# EAGLE design Ignition_speeduino (EAGLE 8.7.1)
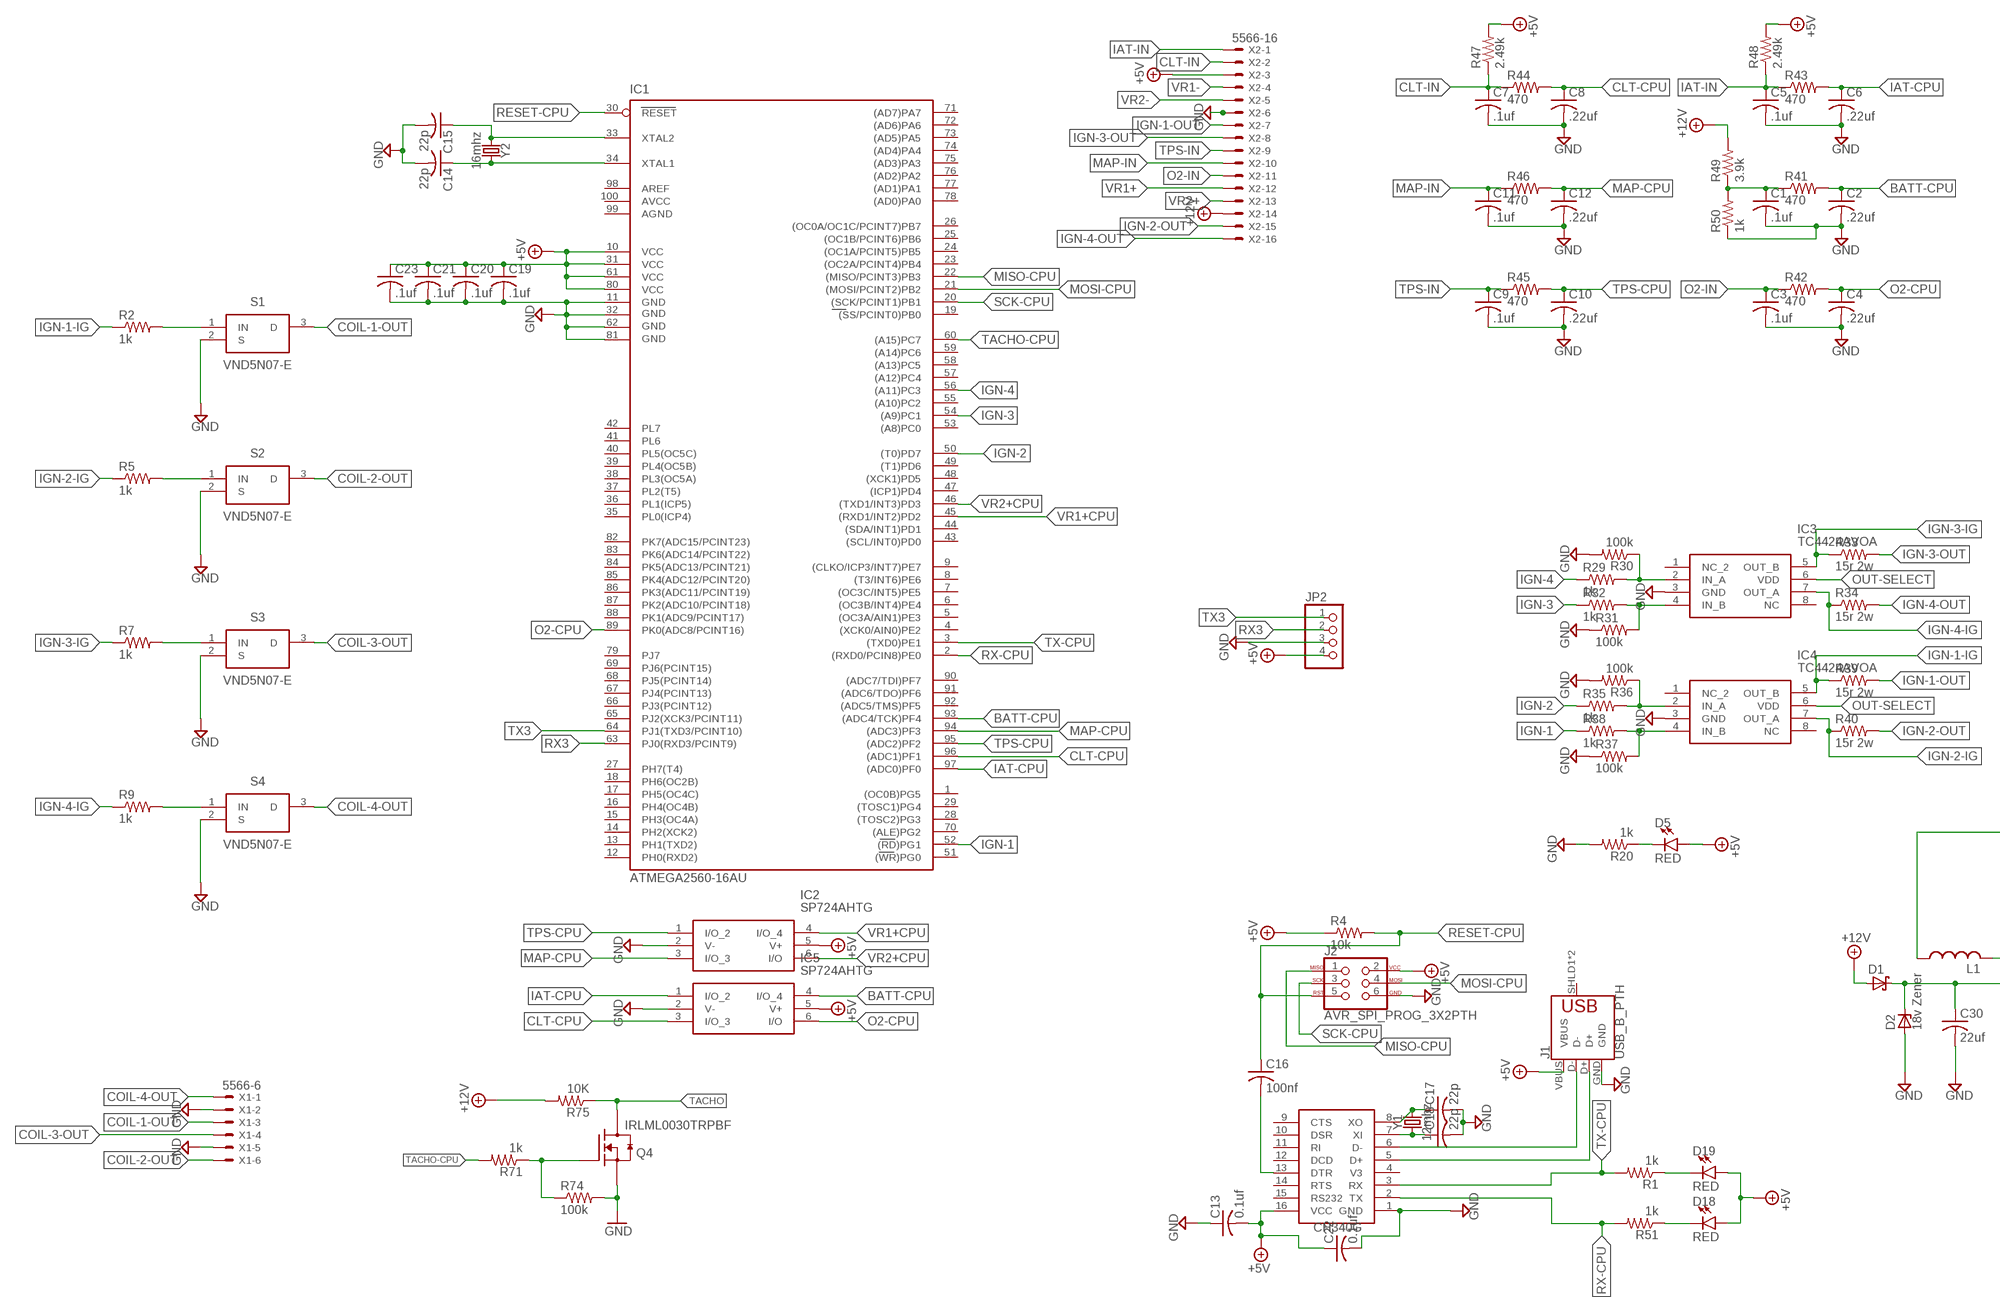
[diagram p0: schematic, sheet 1, part 1 of 2]
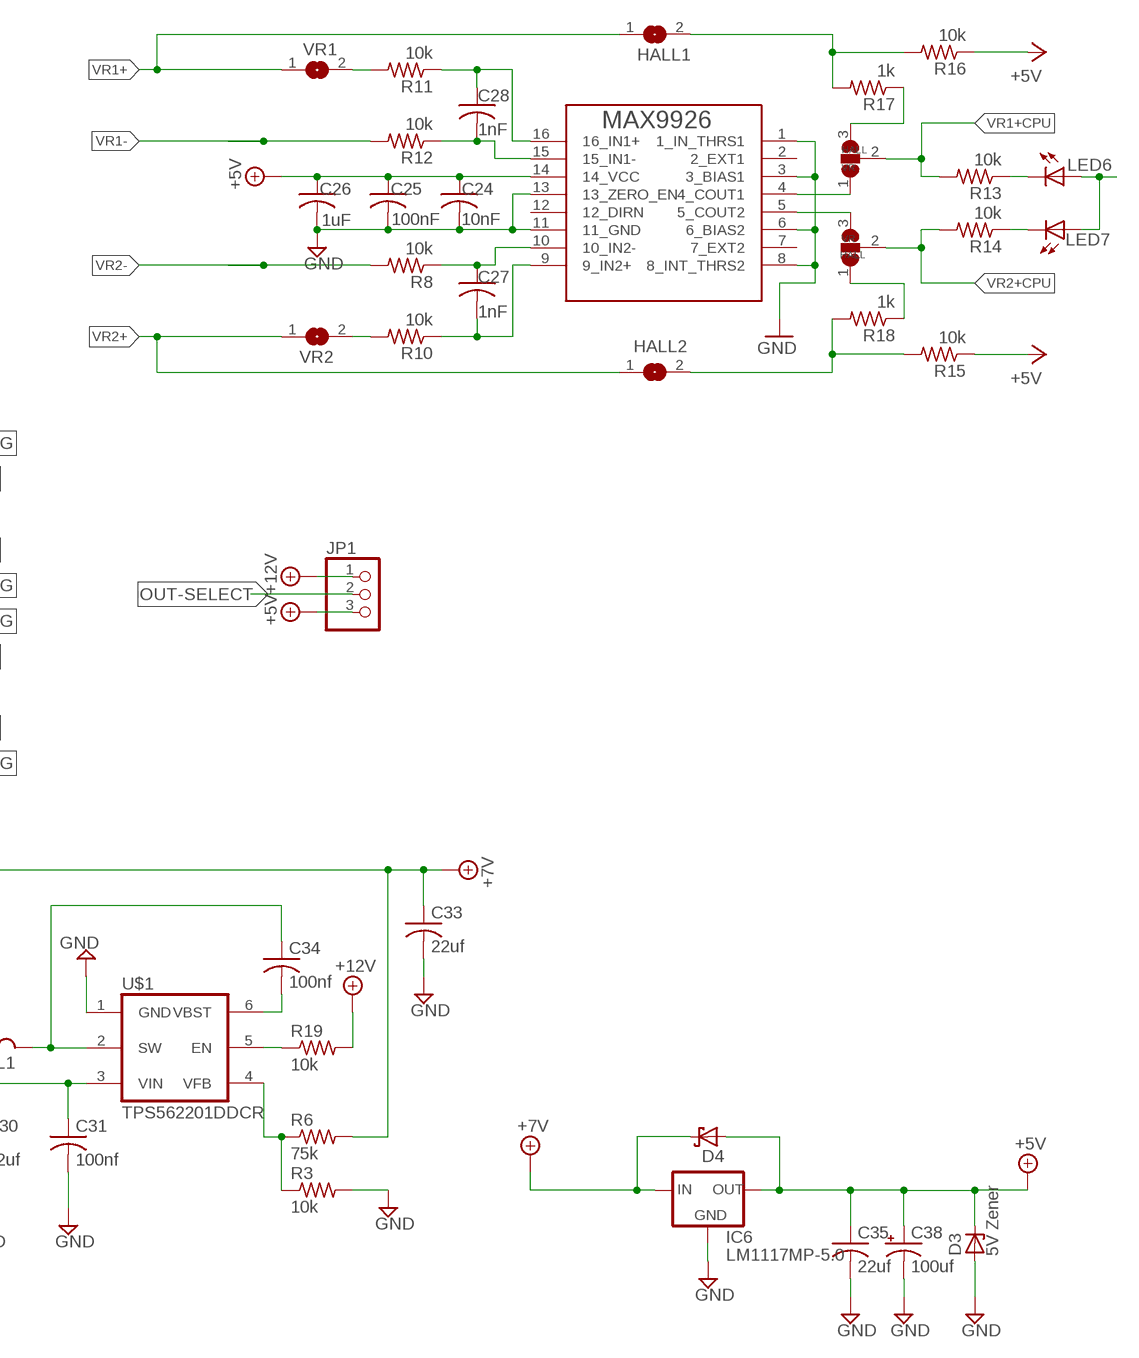
[diagram p1: schematic, sheet 1, part 2 of 2]

## Parts
C1  .1uf  C-USC1206  [C1206]
C2  .22uf  C-USC1206  [C1206]
C3  .1uf  C-USC1206  [C1206]
C4  .22uf  C-USC1206  [C1206]
C5  .1uf  C-USC1206  [C1206]
C6  .22uf  C-USC1206  [C1206]
C7  .1uf  C-USC1206  [C1206]
C8  .22uf  C-USC1206  [C1206]
C9  .1uf  C-USC1206  [C1206]
C10  .22uf  C-USC1206  [C1206]
C11  .1uf  C-USC1206  [C1206]
C12  .22uf  C-USC1206  [C1206]
C13  0.1uf  C-USC1206  [C1206]
C14  22p  C-USC1206  [C1206]
C15  22p  C-USC1206  [C1206]
C16  100nf  C-USC1206  [C1206]
C17  22p  C-USC1206  [C1206]
C18  22p  C-USC1206  [C1206]
C19  .1uf  C-USC1206  [C1206]
C20  .1uf  C-USC1206  [C1206]
C21  .1uf  C-USC1206  [C1206]
C22  0.1uf  C-USC1206  [C1206]
C23  .1uf  C-USC1206  [C1206]
C24  10nF  C-USC1206  [C1206]
C25  100nF  C-USC1206  [C1206]
C26  1uF  C-USC1206  [C1206]
C27  1nF  C-USC1206  [C1206]
C28  1nF  C-USC1206  [C1206]
C30  22uf  C-USC1206  [C1206]
C31  100nf  C-USC1206  [C1206]
C33  22uf  C-USC1206  [C1206]
C34  100nf  C-USC1206  [C1206]
C35  22uf  C-USC1206  [C1206]
C38  100uf  CPOL-US153CLV-0605  [153CLV-0605]
D1  SCHOTTKY-DIODESMD  [SMB]
D2  18v Zener  ZENER-DIODESMB  [SMB]
D3  5V Zener  ZENER-DIODESMB  [SMB]
D4  SCHOTTKY-DIODESMD  [SMB]
D5  RED  LED-RED1206  [LED-1206]
D18  RED  LED-RED1206  [LED-1206]
D19  RED  LED-RED1206  [LED-1206]
HALL1  HALL1  SJ  [SJ]
HALL2  HALL2  SJ  [SJ]
IC1  ATMEGA2560-16AU  [TQFP100]
IC2  SP724AHTG  [SOT95P280X145-6N]
IC3  TC4424AVOA  [SOIC127P600X175-8N]
IC4  TC4424AVOA  [SOIC127P600X175-8N]
IC5  SP724AHTG  [SOT95P280X145-6N]
IC6  LM1117MP-5.0  [SOT223]
J1  USB_B_PTH  [USB-B-PTH]
J2  AVR_SPI_PROG_3X2PTH  [2X3]
JP1  PINHD-1X3  [1X03]
JP2  PINHD-1X4  [1X04]
L1  L-USPIS2816  [PIS2816]
LED6  LEDCHIP-LED0805  [CHIP-LED0805]
LED7  LEDCHIP-LED0805  [CHIP-LED0805]
Q4  IRLML0030TRPBF  MOSFET-NCH_SOT-23  [SOT95P280X135-3N]
R1  1k  R-US_R1206  [R1206]
R2  1k  R-US_R1206  [R1206]
R3  10k  R-US_R1206  [R1206]
R4  10k  R-US_R1206  [R1206]
R5  1k  R-US_R1206  [R1206]
R6  75k  R-US_R1206  [R1206]
R7  1k  R-US_R1206  [R1206]
R8  10k  R-US_R1206  [R1206]
R9  1k  R-US_R1206  [R1206]
R10  10k  R-US_R1206  [R1206]
R11  10k  R-US_R1206  [R1206]
R12  10k  R-US_R1206  [R1206]
R13  10k  R-US_R1206  [R1206]
R14  10k  R-US_R1206  [R1206]
R15  10k  R-US_R1206  [R1206]
R16  10k  R-US_R1206  [R1206]
R17  1k  R-US_R1206  [R1206]
R18  1k  R-US_R1206  [R1206]
R19  10k  R-US_R1206  [R1206]
R20  1k  R-US_R1206  [R1206]
R29  1k  R-US_R1206  [R1206]
R30  100k  R-US_R1206  [R1206]
R31  100k  R-US_R1206  [R1206]
R32  1k  R-US_R1206  [R1206]
R33  15r 2w  R-US_R2512  [R2512]
R34  15r 2w  R-US_R2512  [R2512]
R35  1k  R-US_R1206  [R1206]
R36  100k  R-US_R1206  [R1206]
R37  100k  R-US_R1206  [R1206]
R38  1k  R-US_R1206  [R1206]
R39  15r 2w  R-US_R2512  [R2512]
R40  15r 2w  R-US_R2512  [R2512]
R41  470  R-US_R1206  [R1206]
R42  470  R-US_R1206  [R1206]
R43  470  R-US_R1206  [R1206]
R44  470  R-US_R1206  [R1206]
R45  470  R-US_R1206  [R1206]
R46  470  R-US_R1206  [R1206]
R47  2.49k  R-US_R1206  [R1206]
R48  2.49k  R-US_R1206  [R1206]
R49  3.9k  R-US_R1206  [R1206]
R50  1k  R-US_R1206  [R1206]
R51  1k  R-US_R1206  [R1206]
R71  1k  R-US_R1206  [R1206]
R74  100k  R-US_R1206  [R1206]
R75  10K  R-US_R1206  [R1206]
S1  VND5N07-E  [TO-252-(DPAK)_1]
S2  VND5N07-E  [TO-252-(DPAK)_1]
S3  VND5N07-E  [TO-252-(DPAK)_1]
S4  VND5N07-E  [TO-252-(DPAK)_1]
U$1  TPS562201DDCR  [SOT23-6L]
U$2  CH340G  [SOIC16]
U$10  MAX9926  [QSOP16]
VR1  SJ2W  [SJ_2]
VR1+  VR1  SJ  [SJ]
VR2  SJ2W  [SJ_2]
VR2+  VR2  SJ  [SJ]
X1  5566-6  [5566-6]
X2  5566-16  [5566-16]
Y1  12mhz  CRYSTALPTH-HC49UV  [HC49U]
Y2  16mhz  CRYSTALPTH-HC49UV  [HC49U]

## Nets
+5V [5V+]: C13.2 C19.1 C20.1 C21.1 C22.1 C23.1 C24.1 C25.1 C26.1 C35.1 C38.+ D3.C D4.A D5.A D18.A D19.A IC1.10(VCC) IC1.31(VCC1) IC1.61(VCC2) IC1.80(VCC3) IC2.5(V+) IC5.5(V+) IC6.2(OUT) IC6.4(OUT) J1.VBUS J2.2 JP1.3 JP2.4 LED6.A LED7.A R4.1 R15.1 R16.1 R47.2 R48.2 U$2.16(VCC) U$10.14(14_VCC) X2.3
+7V: C33.1 D4.C IC6.3(IN) L1.1 R6.2
+12V [Power]: D1.A JP1.1 R19.2 R49.2 R75.2 X2.14
BATT-CPU: C2.1 IC1.93((ADC4/TCK)PF4) IC5.4(I/O_4) R41.2
CLT-CPU: C8.1 IC1.96((ADC1)PF1) IC5.3(I/O_3) R44.2
CLT-IN: C7.1 R44.1 R47.1 X2.2
COIL-1-OUT [Output]: S1.3(D) X1.3
COIL-2-OUT [Output]: S2.3(D) X1.6
COIL-3-OUT [Output]: S3.3(D) X1.4
COIL-4-OUT [Output]: S4.3(D) X1.1
GND [GND]: C1.2 C2.2 C3.2 C4.2 C5.2 C6.2 C7.2 C8.2 C9.2 C10.2 C11.2 C12.2 C13.1 C14.2 C15.2 C17.2 C18.2 C19.2 C20.2 C21.2 C22.2 C23.2 C24.2 C25.2 C26.2 C30.2 C31.2 C33.2 C35.2 C38.- D2.A D3.A IC1.11(GND) IC1.32(GND1) IC1.62(GND2) IC1.81(GND3) IC2.2(V-) IC3.3(GND) IC4.3(GND) IC5.2(V-) IC6.1(GND) J1.GND J2.6 JP2.3 Q4.2(S) R3.2 R20.2 R30.2 R31.1 R36.2 R37.1 R50.1 R74.2 S1.2(S) S2.2(S) S3.2(S) S4.2(S) U$1.1(GND) U$2.1(GND) U$10.1(1_IN_THRS1) U$10.3(3_BIAS1) U$10.6(6_BIAS2) U$10.8(8_INT_THRS2) U$10.11(11_GND) U$10.13(13_ZERO_EN) X1.2 X1.5 X2.6
IAT-CPU: C6.1 IC1.97((ADC0)PF0) IC5.1(I/O_2) R43.2
IAT-IN: C5.1 R43.1 R48.1 X2.1
IGN-1: IC1.52((RD)PG1) R38.1
IGN-1-IG [IGN]: IC4.5(OUT_B) R2.1 R39.1
IGN-1-OUT [IGN]: R39.2 X2.7
IGN-2: IC1.50((T0)PD7) R35.1
IGN-2-IG [IGN]: IC4.7(OUT_A) R5.1 R40.1
IGN-2-OUT [IGN]: R40.2 X2.15
IGN-3: IC1.54((A9)PC1) R32.1
IGN-3-IG: IC3.5(OUT_B) R7.1 R33.1
IGN-3-OUT [IGN]: R33.2 X2.8
IGN-4: IC1.56((A11)PC3) R29.1
IGN-4-IG [IGN]: IC3.7(OUT_A) R9.1 R34.1
IGN-4-OUT [IGN]: R34.2 X2.16
MAP-CPU: C12.1 IC1.94((ADC3)PF3) IC2.3(I/O_3) R46.2
MAP-IN: C11.1 R46.1 X2.10
MISO-CPU: IC1.22((MISO/PCINT3)PB3) J2.1
MOSI-CPU: IC1.21((MOSI/PCINT2)PB2) J2.4
N$1: R2.2 S1.1(IN)
N$2: J1.D+ U$2.5(D+)
N$3: J1.D- U$2.6(D-)
N$4: R5.2 S2.1(IN)
N$5: C14.1 IC1.34(XTAL1) Y2.2
N$6: C15.1 IC1.33(XTAL2) Y2.1
N$7: R7.2 S3.1(IN)
N$8: D5.C R20.1
N$9: C16.2 U$2.13(DTR)
N$10: R9.2 S4.1(IN)
N$11: HALL1.2 R16.2 R17.2
N$12: C27.1 R8.1 U$10.10(10_IN2-)
N$14: C28.2 R12.1 U$10.15(15_IN1-)
N$15: C18.1 U$2.7(XI) Y1.1
N$16: C17.1 U$2.8(XO) Y1.2
N$17: R10.2 VR2+.2
N$18: U$10.4(4_COUT1) VR1.1
N$19: R17.1 VR1.3
N$20: U$10.5(5_COUT2) VR2.3
N$21: R18.1 VR2.1
N$22: C30.1 C31.1 D1.C D2.C U$1.3(VIN)
N$23: C34.2 U$1.6(VBST)
N$24: R19.1 U$1.5(EN)
N$28: HALL2.2 R15.2 R18.2
N$29: Q4.1(G) R71.1 R74.1
N$33: IC3.2(IN_A) R29.2 R30.1
N$34: IC3.4(IN_B) R31.2 R32.2
N$35: C27.2 R10.1 U$10.9(9_IN2+)
N$36: C28.1 R11.1 U$10.16(16_IN1+)
N$37: IC4.2(IN_A) R35.2 R36.1
N$38: IC4.4(IN_B) R37.2 R38.2
N$42: C1.1 R41.1 R49.1 R50.2
N$48: R11.2 VR1+.2
N$49: LED7.C R14.1
N$50: LED6.C R13.1
N$100: D19.C R1.1
N$101: D18.C R51.1
O2-CPU: C4.1 IC1.89(PK0(ADC8/PCINT16)) IC5.6(I/O) R42.2
O2-IN: C3.1 R42.1 X2.11
OUT-SELECT [IGN]: IC3.6(VDD) IC4.6(VDD) JP1.2
RESET-CPU: C16.1 IC1.30(RESET) J2.5 R4.2
RX3: IC1.63(PJ0(RXD3/PCINT9)) JP2.2
RX-CPU: IC1.2((RXD0/PCIN8)PE0) R51.2 U$2.2(TX)
SCK-CPU: IC1.20((SCK/PCINT1)PB1) J2.3
SW: C34.1 L1.2 U$1.2(SW)
TACHO: Q4.3(D) R75.1
TACHO-CPU: IC1.60((A15)PC7) R71.2
TPS-CPU: C10.1 IC1.95((ADC2)PF2) IC2.1(I/O_2) R45.2
TPS-IN: C9.1 R45.1 X2.9
TX3: IC1.64(PJ1(TXD3/PCINT10)) JP2.1
TX-CPU: IC1.3((TXD0)PE1) R1.2 U$2.3(RX)
VFB: R3.1 R6.1 U$1.4(VFB)
VR1+: HALL1.1 VR1+.1 X2.12
VR1+CPU: IC1.45((RXD1/INT2)PD2) IC2.4(I/O_4) R13.2 VR1.2
VR1-: R12.2 X2.4
VR2+: HALL2.1 VR2+.1 X2.13
VR2+CPU: IC1.46((TXD1/INT3)PD3) IC2.6(I/O) R14.2 VR2.2
VR2-: R8.2 X2.5
Unconnected: IC1.1((OC0B)PG5) IC1.4((XCK0/AIN0)PE2) IC1.5((OC3A/AIN1)PE3) IC1.6((OC3B/INT4)PE4) IC1.7((OC3C/INT5)PE5) IC1.8((T3/INT6)PE6) IC1.9((CLKO/ICP3/INT7)PE7) IC1.12(PH0(RXD2)) IC1.13(PH1(TXD2)) IC1.14(PH2(XCK2)) IC1.15(PH3(OC4A)) IC1.16(PH4(OC4B)) IC1.17(PH5(OC4C)) IC1.18(PH6(OC2B)) IC1.19((SS/PCINT0)PB0) IC1.23((OC2A/PCINT4)PB4) IC1.24((OC1A/PCINT5)PB5) IC1.25((OC1B/PCINT6)PB6) IC1.26((OC0A/OC1C/PCINT7)PB7) IC1.27(PH7(T4)) IC1.28((TOSC2)PG3) IC1.29((TOSC1)PG4) IC1.35(PL0(ICP4)) IC1.36(PL1(ICP5)) IC1.37(PL2(T5)) IC1.38(PL3(OC5A)) IC1.39(PL4(OC5B)) IC1.40(PL5(OC5C)) IC1.41(PL6) IC1.42(PL7) IC1.43((SCL/INT0)PD0) IC1.44((SDA/INT1)PD1) IC1.47((ICP1)PD4) IC1.48((XCK1)PD5) IC1.49((T1)PD6) IC1.51((WR)PG0) IC1.53((A8)PC0) IC1.55((A10)PC2) IC1.57((A12)PC4) IC1.58((A13)PC5) IC1.59((A14)PC6) IC1.65(PJ2(XCK3/PCINT11)) IC1.66(PJ3(PCINT12)) IC1.67(PJ4(PCINT13)) IC1.68(PJ5(PCINT14)) IC1.69(PJ6(PCINT15)) IC1.70((ALE)PG2) IC1.71((AD7)PA7) IC1.72((AD6)PA6) IC1.73((AD5)PA5) IC1.74((AD4)PA4) IC1.75((AD3)PA3) IC1.76((AD2)PA2) IC1.77((AD1)PA1) IC1.78((AD0)PA0) IC1.79(PJ7) IC1.82(PK7(ADC15/PCINT23)) IC1.83(PK6(ADC14/PCINT22)) IC1.84(PK5(ADC13/PCINT21)) IC1.85(PK4(ADC12/PCINT20)) IC1.86(PK3(ADC11/PCINT19)) IC1.87(PK2(ADC10/PCINT18)) IC1.88(PK1(ADC9/PCINT17)) IC1.90((ADC7/TDI)PF7) IC1.91((ADC6/TDO)PF6) IC1.92((ADC5/TMS)PF5) IC1.98(AREF) IC3.1(NC_2) IC3.8(NC) IC4.1(NC_2) IC4.8(NC) J1.SHLD1(SHIELD) J1.SHLD2(SHIELD) U$2.4(V3) U$2.9(CTS) U$2.10(DSR) U$2.11(RI) U$2.12(DCD) U$2.14(RTS) U$2.15(RS232) U$10.2(2_EXT1) U$10.7(7_EXT2) U$10.12(12_DIRN)

## Notes on the sheet
- HALL
- VR
- VR
- HALL

## Power pins joined to a net without a drawn wire
AGND: IC1.99(AGND)
AVCC: IC1.100(AVCC)

## Library data of the parts
C1-C28 C30 C31 C34 = resistor:C-US: CAPACITOR, American symbol
C33 C35 = resistor:C-US: CAPACITOR, American symbol; SPICEPREFIX: C
C38 = resistor:CPOL-US: POLARIZED CAPACITOR, American symbol
D1 D4 = diode:SCHOTTKY-DIODE: Schottky Diode
D2 D3 = diode:ZENER-DIODE: Z-Diode
D5 D18 D19 = SparkFun-LED:LED-RED: Red SMD LED Used in manufacturing of most products at SparkFun Packages: 0603 - SMD 0603 package [Product Link] <http://docs.avagotech.com/docs/AV02-0551EN> 0603 SMART - SMD 0603 SMART package ( more efficient and expensive)[Product Link] <http://www.osram-os.com/Graphics/XPic2/00077099_0.pdf> 1206 - SMD1206 package [Product Link] <https://www.sparkfun.com/datasheets/DevTools/LilyPad/Q150OVS4.pdff> SparkFun Products: Pro Mini 328 -5V <https://www.sparkfun.com/products/821> RedBoard <https://www.sparkfun.com/products/12757> IOIO-OTG <https://www.sparkfun.com/products/13613>; PROD_ID: DIO-09912
HALL1 HALL2 VR1+ VR2+ = jumper:SJ: SMD solder JUMPER
IC1 = atmel-2005:ATMEGA*: MICROCONTROLLER 64/128/256 Kbytes FLASH 4 Kbytes EEPROM 8 Kbytes SRAM 86 General Purpose I/O pins 12-channels16-bit PWM 4 x Serial USARTs 16-channels 10-bit A/D
IC2 IC5 = SP724AHTG:SP724AHTG: Littelfuse SP724AHTG Quad Uni-Directional Over-voltage Protector, 6-Pin SOT-23 Source: Datasheet; ARROW_PART_NUMBER: SP724AHTG; ARROW_PRICE/STOCK: https://www.arrow.com/en/products/sp724ahtg/littelfuse; DESCRIPTION: Littelfuse SP724AHTG Quad Uni-Directional Over-voltage Protector, 6-Pin SOT-23; HEIGHT: mm; MANUFACTURER_NAME: LITTELFUSE; MANUFACTURER_PART_NUMBER: SP724AHTG; RS_PART_NUMBER: 7931982; RS_PRICE/STOCK: http://uk.rs-online.com/web/p/products/7931982
IC3 IC4 = TC4424AVOA:TC4424AVOA: 3A Dual High-Speed Power MOSFET Drivers Source: Datasheet <http://componentsearchengine.com/Datasheets/1/TC4424AVOA.pdf>; DESCRIPTION: 3A Dual High-Speed Power MOSFET Drivers; HEIGHT: mm; MANUFACTURER_NAME: Microchip; MANUFACTURER_PART_NUMBER: TC4424AVOA; SUPPLIER_NAME: RS
IC6 = lm1117_10:LM1117?-*: 800mA Low-Dropout Linear Regulator Source: http://www.ti.com/lit/ds/symlink/lm1117-n.pdf; MF: Texas Instruments; MPN: LM1117MP-5.0; OC_FARNELL: 9778209; OC_NEWARK: 28X3417
J1 = SparkFun-Connectors:USB_B: USB Type B Connector SparkFun Products: SparkFun Stepoko <https://www.sparkfun.com/products/13899> PTH; PROD_ID: CONN-08278; SF_ID: PRT-00139
J2 = SparkFun-Connectors:AVR_SPI_PROG_3X2: AVR ISP 6 Pin This is the reduced ISP connector for AVR programming. Common on Arduino. This footprint will take up less PCB space and can be used with a 10-pin to 6-pin adapter such as SKU: BOB-08508 **Special note about "TEST_POINT" package. The stop mask is on the top side, so if you want your programming test points to be on the bottom of your board, make sure to place this package on the bottom side of the board. This also ensure that the orientation to program from the bottom side will be correct. SparkFun Products: SparkFun ISP Pogo Adapter <https://www.sparkfun.com/products/11591> - NS Tiny AVR Programmer <https://www.sparkfun.com/products/11801> -PTH
JP1 = pinhead:PINHD-1X3: PIN HEADER
JP2 = pinhead:PINHD-1X4: PIN HEADER
L1 = rcl:L-US: INDUCTOR, American symbol
LED6 LED7 = led:LED: LED OSRAM: - CHIPLED LG R971, LG N971, LY N971, LG Q971, LY Q971, LO R971, LY R971 LH N974, LH R974 LS Q976, LO Q976, LY Q976 LO Q996 - Hyper CHIPLED LW Q18S LB Q993, LB Q99A, LB R99A - SideLED LS A670, LO A670, LY A670, LG A670, LP A670 LB A673, LV A673, LT A673, LW A673 LH A674 LY A675 LS A676, LA A676, LO A676, LY A676, LW A676 LS A679, LY A679, LG A679 - Hyper Micro SIDELED® LS Y876, LA Y876, LO Y876, LY Y876 LT Y87S - SmartLED LW L88C, LW L88S LB L89C, LB L89S, LG L890 LS L89K, LO L89K, LY L89K LS L896, LA L896, LO L896, LY L896 - TOPLED LS T670, LO T670, LY T670, LG T670, LP T670 LSG T670, LSP T670, LSY T670, LOP T670, LYG T670 LG T671, LOG T671, LSG T671 LB T673, LV T673, LT T673, LW T673 LH T674 LS T676, LA T676, LO T676, LY T676, LB T676, LH T676, LSB T676, LW T676 LB T67C, LV T67C, LT T67C, LS T67K, LO T67K, LY T67K, LW E67C LS E67B, LA E67B, LO E67B, LY E67B, LB E67C, LV E67C, LT E67C LW T67C LS T679, LY T679, LG T679 LS T770, LO T770, LY T770, LG T770, LP T770 LB T773, LV T773, LT T773, LW T773 LH T774 LS E675, LA E675, LY E675, LS T675 LS T776, LA T776, LO T776, LY T776, LB T776 LHGB T686 LT T68C, LB T68C - Hyper Mini TOPLED® LB M676 - Mini TOPLED Santana® LG M470 LS M47K, LO M47K, LY M47K Source: http://www.osram.convergy.de LUXEON: - LUMILED® LXK2-PW12-R00, LXK2-PW12-S00, LXK2-PW14-U00, LXK2-PW14-V00 LXK2-PM12-R00, LXK2-PM12-S00, LXK2-PM14-U00 LXK2-PE12-Q00, LXK2-PE12-R00, LXK2-PE12-S00, LXK2-PE14-T00, LXK2-PE14-U00 LXK2-PB12-K00, LXK2-PB12-L00, LXK2-PB12-M00, LXK2-PB14-N00, LXK2-PB14-P00, LXK2-PB14-Q00 LXK2-PR12-L00, LXK2-PR12-M00, LXK2-PR14-Q00, LXK2-PR14-R00 LXK2-PD12-Q00, LXK2-PD12-R00, LXK2-PD12-S00 LXK2-PH12-R00, LXK2-PH12-S00 LXK2-PL12-P00, LXK2-PL12-Q00, LXK2-PL12-R00 Source: www.luxeon.com KINGBRIGHT: KA-3528ASYC Source: www.kingbright.com
Q4 = ipc-7351-transistor:MOSFET-NCH_
R1-R20 R29-R51 R71 R74 R75 = resistor:R-US_: RESISTOR, American symbol
S1-S4 = VND5N07-E:VND5N07-E: Power Switch Low-Side OMNIFET 5A TO252 STMicroelectronics VND5N07-E Intelligent Power Switch, OMNIFET: Fully Autoprotected Power MOSFET, 5A, 70V, 3-Pin <https://componentsearchengine.com/Images/3/VND5N07-E.jpg> Source: Datasheet <http://www.st.com/web/en/resource/technical/document/datasheet/DM00091993.pdf>; ALLIED_NUMBER: 70389716; DESCRIPTION: Power Switch Low-Side OMNIFET 5A TO252 STMicroelectronics VND5N07-E Intelligent Power Switch, OMNIFET: Fully Autoprotected Power MOSFET, 5A, 70V, 3-Pin; HEIGHT: mm; MANUFACTURER_NAME: STMicroelectronics; MANUFACTURER_PART_NUMBER: VND5N07-E; RS_PART_NUMBER: 3511351; SUPPLIER_NAME: RS
U$1 = TPS562201DDCR:TPS562201DDCR
U$2 = ch340g:CH340G
U$10 = max9926:MAX9926
VR1 VR2 = jumper:SJ2W: SMD solder JUMPER
X1 = Molex_connectors:5566-6: Mini FIT connector 6 pol Source: http://www.molex.com; MF: MOLEX; MPN: 95566-61002; OC_FARNELL: unknown; OC_NEWARK: 22K8620
X2 = Molex_connectors:5566-16: Mini FIT connector 16 pol Source: http://www.molex.com; MF: MOLEX; OC_FARNELL: unknown; OC_NEWARK: unknown
Y1 Y2 = SparkFun-Clocks:CRYSTAL: Crystals (Generic) These are passive quartz crystals, which can be used as a clock source for a microcontroller. Crystal's are two-terminal devices. They require external "load" capacitors to generate an oscillating signal.

## Net classes
0 default: width 0.254 mm, clearance 0.152 mm
1 Power: width 1.016 mm, clearance 0.152 mm
2 Output: width 1.27 mm, clearance 0.152 mm
3 IGN: width 0.61 mm, clearance 0.152 mm
4 5V+: width 0.305 mm, clearance 0.152 mm
5 Relay: width 0.406 mm, clearance 0.152 mm
6 GND: width 0.305 mm, clearance 0.152 mm

## Board
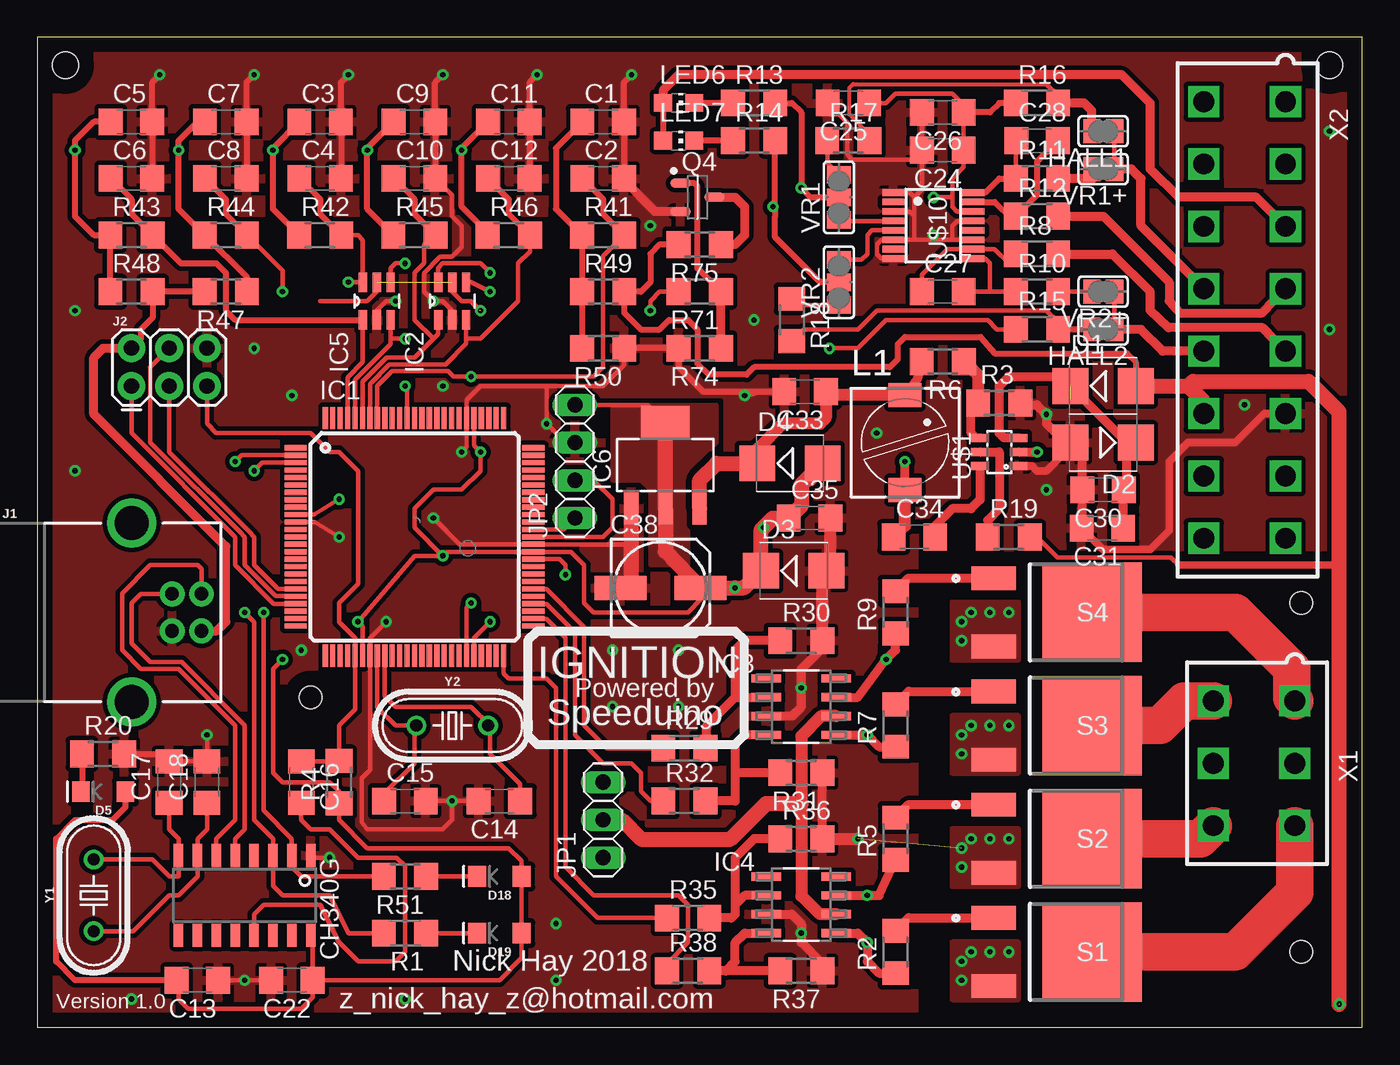
[diagram p2: board, top side]
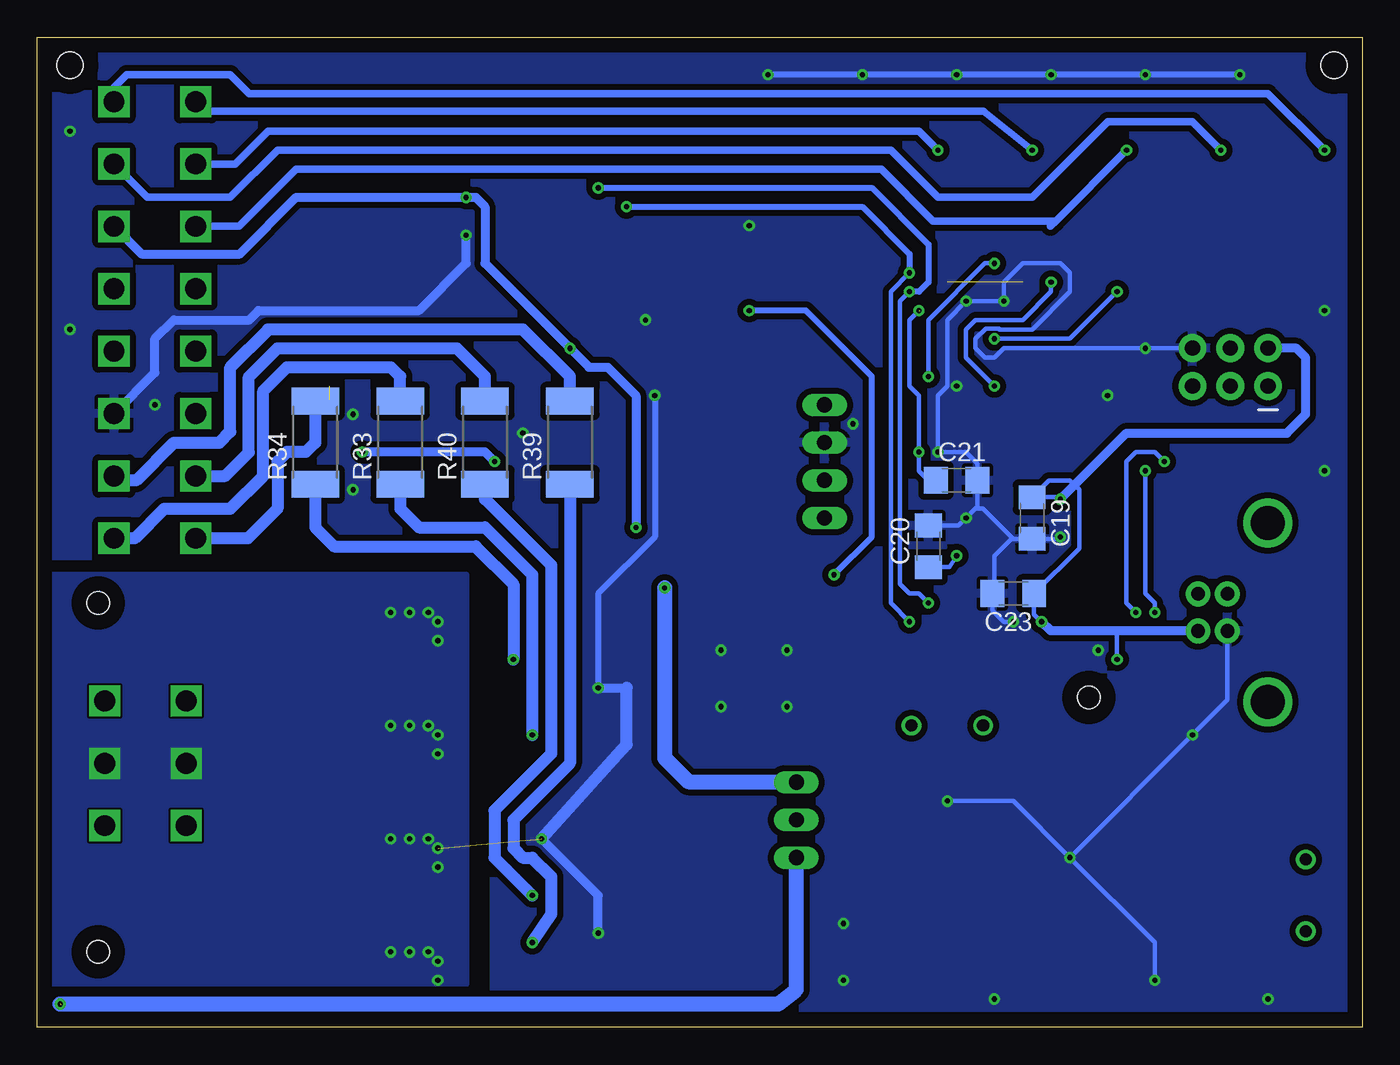
[diagram p3: board, bottom side, seen from below]

Size 89.2 x 66.67 mm. Coordinates in mm from the lower left corner, seen from the top.
Outline: 0,0 89.2,0 89.2,66.67 0,66.67 0,0
Copper layers (1*16): Top 0.035mm / dielectric 1.5mm / Bottom 0.035mm
Design rules "default": minimum track width 6mil, minimum drill 0.35mm, track to track 6mil, track to pad 6mil, pad to pad 6mil, via to via 6mil, smd to smd 6mil, copper to edge 40mil, drill to drill 6mil, minimum pad ring 10mil, minimum via ring 8mil, stop-mask expansion 4mil, vias tented up to drill 0mil, thermal gap 10mil
Holes 1.78 mm at 1.91,64.77 87,64.77
Holes 1.52 mm at 85.09,5.08 85.09,28.57 18.41,22.23

### Footprints (pad centres in the part's own frame; a part is rotated, then mirrored left to right if it is on the bottom)
C1206 = smd 1.6 x 1.8: 1 -1.4,0; 2 1.4,0
153CLV-0605 = smd 3.5 x 1.6: + 2.7,0; - -2.7,0
SMB = smd 2.4 x 2.4: A 2.2,0; C -2.2,0
LED-1206 = smd 1.2 x 1.4: A -1.5,0; C 1.5,0
SJ = smd 1.168 x 1.6: 1 -0.762,0; 2 0.762,0
TQFP100 = smd 1.5 x 0.35: 1 -8,6; 2 -8,5.5; 3 -8,5; 4 -8,4.5; 5 -8,4; 6 -8,3.5; 7 -8,3; 8 -8,2.5; 9 -8,2; 10 -8,1.5; 11 -8,1; 12 -8,0.5; 13 -8,0; 14 -8,-0.5; 15 -8,-1; 16 -8,-1.5; 17 -8,-2; 18 -8,-2.5; 19 -8,-3; 20 -8,-3.5; 21 -8,-4; 22 -8,-4.5; 23 -8,-5; 24 -8,-5.5; 25 -8,-6; 51 8,-6; 52 8,-5.5; 53 8,-5; 54 8,-4.5; 55 8,-4; 56 8,-3.5; 57 8,-3; 58 8,-2.5; 59 8,-2; 60 8,-1.5; 61 8,-1; 62 8,-0.5; 63 8,0; 64 8,0.5; 65 8,1; 66 8,1.5; 67 8,2; 68 8,2.5; 69 8,3; 70 8,3.5; 71 8,4; 72 8,4.5; 73 8,5; 74 8,5.5; 75 8,6 | smd 0.35 x 1.5: 26 -6,-8; 27 -5.5,-8; 28 -5,-8; 29 -4.5,-8; 30 -4,-8; 31 -3.5,-8; 32 -3,-8; 33 -2.5,-8; 34 -2,-8; 35 -1.5,-8; 36 -1,-8; 37 -0.5,-8; 38 0,-8; 39 0.5,-8; 40 1,-8; 41 1.5,-8; 42 2,-8; 43 2.5,-8; 44 3,-8; 45 3.5,-8; 46 4,-8; 47 4.5,-8; 48 5,-8; 49 5.5,-8; 50 6,-8; 76 6,8; 77 5.5,8; 78 5,8; 79 4.5,8; 80 4,8; 81 3.5,8; 82 3,8; 83 2.5,8; 84 2,8; 85 1.5,8; 86 1,8; 87 0.5,8; 88 0,8; 89 -0.5,8; 90 -1,8; 91 -1.5,8; 92 -2,8; 93 -2.5,8; 94 -3,8; 95 -3.5,8; 96 -4,8; 97 -4.5,8; 98 -5,8; 99 -5.5,8; 100 -6,8
SOT95P280X145-6N = smd 1.321 x 0.559: 1 -1.27,0.94; 2 -1.27,0; 3 -1.27,-0.94; 4 1.27,-0.94; 5 1.27,0; 6 1.27,0.94
SOIC127P600X175-8N = smd 1.981 x 0.559: 1 -2.362,1.905; 2 -2.362,0.635; 3 -2.362,-0.635; 4 -2.362,-1.905; 5 2.362,-1.905; 6 2.362,-0.635; 7 2.362,0.635; 8 2.362,1.905
SOT223 = smd 0.95 x 2.15: 1 -2.3,-2.9; 2 0,-2.9; 3 2.3,-2.9 | smd 3.25 x 2.15: 4 0,2.9
USB-B-PTH = drill 0.914 pad 1.676: D+ 4,1.25; D- 5.981,1.25; GND 4,-1.25; VBUS 5.981,-1.25 | drill 2.286: SHLD1 1.282,-6.02; SHLD2 1.282,6.02
2X3 = drill 1.016 pad 1.88: 1 0,0; 2 0,2.54; 3 2.54,0; 4 2.54,2.54; 5 5.08,0; 6 5.08,2.54
1X03 = drill 1.016 long: 1 -2.54,0; 2 0,0; 3 2.54,0
1X04 = drill 1.016 long: 1 -3.81,0; 2 -1.27,0; 3 1.27,0; 4 3.81,0
PIS2816 = smd 2.2 x 1.6: 1 0,3.2; 2 0,-3.2
CHIP-LED0805 = smd 1.2 x 1.2: A 0,-1.05; C 0,1.05
SOT95P280X135-3N = smd 1.4 x 0.65: 1 -1.15,0.95; 2 -1.15,-0.95; 3 1.15,0
R1206 = smd 1.6 x 1.803: 1 -1.422,0; 2 1.422,0
R2512 = smd 1.8 x 3.2: 1 -2.8,0; 2 2.8,0
TO-252-(DPAK)_1 = smd 3 x 1.6: 1 8.65,-2.3; 2 8.65,2.3 | smd 6.7 x 6.7: 3 2,0
SOT23-6L = smd 0.55 x 1.2: 1 -0.95,-1.3; 2 0,-1.3; 3 0.95,-1.3; 4 0.95,1.3; 5 0,1.3; 6 -0.95,1.3
SOIC16 = smd 0.635 x 1.524: 1 -4.445,-2.695; 2 -3.175,-2.695; 3 -1.905,-2.695; 4 -0.635,-2.695; 5 0.635,-2.695; 6 1.905,-2.695; 7 3.175,-2.695; 8 4.445,-2.695; 9 4.445,2.695; 10 3.175,2.695; 11 1.905,2.695; 12 0.635,2.695; 13 -0.635,2.695; 14 -1.905,2.695; 15 -3.175,2.695; 16 -4.445,2.695
QSOP16 = smd 0.45 x 1.5: 1 -2.223,-2.69; 2 -1.587,-2.69; 3 -0.953,-2.69; 4 -0.318,-2.69; 5 0.318,-2.69; 6 0.953,-2.69; 7 1.587,-2.69; 8 2.223,-2.69; 9 2.223,2.69; 10 1.587,2.69; 11 0.953,2.69; 12 0.318,2.69; 13 -0.318,2.69; 14 -0.953,2.69; 15 -1.587,2.69; 16 -2.223,2.69
SJ_2 = smd 1.168 x 1.6: 1 -1.524,0; 2 0,0; 3 1.524,0
5566-6 = drill 1.4 square: 1 4.2,-2.75; 2 0,-2.75; 3 -4.2,-2.75; 4 4.2,2.75; 5 0,2.75; 6 -4.2,2.75
5566-16 = drill 1.4 square: 1 14.7,-2.75; 2 10.5,-2.75; 3 6.3,-2.75; 4 2.1,-2.75; 5 -2.1,-2.75; 6 -6.3,-2.75; 7 -10.5,-2.75; 8 -14.7,-2.75; 9 14.7,2.75; 10 10.5,2.75; 11 6.3,2.75; 12 2.1,2.75; 13 -2.1,2.75; 14 -6.3,2.75; 15 -10.5,2.75; 16 -14.7,2.75
HC49U = drill 0.813: 1 -2.413,0; 2 2.413,0

### Placement (x,y rotation side)
C1  38.1,60.96 0 top
C2  38.1,57.15 0 top
C3  19.05,60.96 0 top
C4  19.05,57.15 0 top
C5  6.35,60.96 0 top
C6  6.35,57.15 0 top
C7  12.7,60.96 0 top
C8  12.7,57.15 0 top
C9  25.4,60.96 0 top
C10  25.4,57.15 0 top
C11  31.75,60.96 0 top
C12  31.75,57.15 0 top
C13  10.79,3.17 180 top
C14  31.11,15.24 180 top
C15  24.77,15.24 0 top
C16  17.78,16.51 270 top
C17  8.89,16.51 90 top
C18  11.43,16.51 90 top
C19  22.23,34.29 270 bottom
C20  29.21,32.38 90 bottom
C21  27.3,36.83 0 bottom
C22  17.14,3.17 180 top
C23  23.5,29.21 180 bottom
C24  60.96,59.05 180 top
C25  54.61,62.23 180 top
C26  60.96,61.59 180 top
C27  60.96,49.53 0 top
C28  67.31,59.69 0 top
C30  71.75,36.2 180 top
C31  71.7,33.6 180 top
C33  51.69,42.8 180 top
C34  59.05,33.02 0 top
C35  51.99,34.29 0 top
C38  41.96,29.59 0 top
D1  71.75,43.18 0 top
D2  71.75,39.37 180 top
D3  50.93,30.73 0 top
D4  50.67,37.97 0 top
D5  4.45,15.88 180 top
D18  31.11,10.16 180 top
D19  31.11,6.35 180 top
HALL1  71.75,60.33 180 top
HALL2  71.75,46.99 180 top
IC1  25.4,33.02 0 top
IC2  27.94,48.9 90 top
IC3  51.44,21.59 0 top
IC4  51.44,8.26 0 top
IC5  22.86,48.9 90 top
IC6  42.29,37.85 0 top
J1  5.08,27.94 0 top
J2  6.35,43.18 0 top
JP1  38.1,13.97 90 top
JP2  36.2,38.1 90 top
L1  58.42,39.37 0 top
LED6  43.18,62.23 270 top
LED7  43.18,59.69 270 top
Q4  44.45,55.88 0 top
R1  24.77,6.35 180 top
R2  57.78,5.08 90 top
R3  64.77,42.04 0 top
R4  20.32,16.51 90 top
R5  57.78,12.7 90 top
R6  60.96,44.83 180 top
R7  57.78,20.32 90 top
R8  67.31,52.07 0 top
R9  57.78,27.94 90 top
R10  67.31,49.53 0 top
R11  67.31,57.15 0 top
R12  67.31,54.61 0 top
R13  48.26,62.23 0 top
R14  48.26,59.69 0 top
R15  67.31,46.99 0 top
R16  67.31,62.23 0 top
R17  54.61,59.69 0 top
R18  50.8,47.62 270 top
R19  65.41,33.02 0 top
R20  4.45,18.41 0 top
R29  43.56,18.8 0 top
R30  51.44,26.04 0 top
R31  51.44,17.14 180 top
R32  43.56,15.24 0 top
R33  64.77,39.37 90 bottom
R34  70.48,39.37 90 bottom
R35  43.81,7.37 0 top
R36  51.44,12.7 0 top
R37  51.44,3.81 180 top
R38  43.81,3.81 0 top
R39  53.34,39.37 90 bottom
R40  59.05,39.37 90 bottom
R41  38.1,53.34 0 top
R42  19.05,53.34 0 top
R43  6.35,53.34 0 top
R44  12.7,53.34 0 top
R45  25.4,53.34 0 top
R46  31.75,53.34 0 top
R47  12.7,49.53 180 top
R48  6.35,49.53 0 top
R49  38.1,49.53 0 top
R50  38.1,45.72 180 top
R51  24.77,10.16 180 top
R71  44.6,49.53 180 top
R74  44.6,45.72 180 top
R75  44.6,52.7 180 top
S1  73.03,5.08 180 top
S2  73.03,12.7 180 top
S3  73.03,20.32 180 top
S4  73.03,27.94 180 top
U$1  64.77,38.73 90 top
U$2  13.97,8.89 180 top
U$10  60.33,53.98 270 top
VR1  53.98,55.88 90 top
VR1+  71.75,57.78 180 top
VR2  53.98,50.16 90 top
VR2+  71.75,49.53 180 top
X1  81.92,17.78 90 top
X2  81.28,47.62 90 top
Y1  3.81,8.89 90 top
Y2  27.94,20.32 0 top

### Tracks (layer width: path | path; a pad name or v marks a point on that pad's centre or on a via)
+5V  (via drill 0.35)  (2 unrouted)
  Top 0.305: C13.2 9.53,3.04 9.53,1.91 10.16,1.27 17.78,1.27 18.55,2.04 C22.1 | C22.1 18.55,6.07 U$2.16 | C22.1 31.11,3.17 32.62,4.67 D19.A D18.A 32.62,11.2 31.75,12.06 22.23,12.06 20.32,13.97 R4.1 20.32,15.88 19.68,16.51 16.51,16.51 15.88,17.14 15.88,24.13 v16.51,24.77 | IC1.10 18.64,34.52 v20.32,35.56 | v27.3,31.75 27.57,32.02 IC1.61 35.92,32.02 36.83,31.11 36.83,28.57 37.47,27.94 43.81,27.94 44.74,28.86 C38.+ 44.74,29.5 | IC1.80 29.4,39.18 v29.84,38.73 29.84,37.47 28.57,36.2 26.67,36.2 25.4,34.92 25.4,33.66 v27.3,31.75 | IC1.31 21.9,27 v21.59,27.3 25.4,31.75 v27.3,31.75 | IC5.5 22.86,49.53 22.23,48.9 19.05,48.9 | IC2.5 27.94,49.53 28.57,48.9 29.21,48.9 | 29.21,48.9 29.8,48.31 29.8,48.26 29.21,48.85 29.21,48.9 | U$10.14 61.91,54.93 61.59,55.24 61.59,55.88 | 61.59,55.88 61.59,57.15 62.36,57.91 C24.1 C26.1 62.36,62.1 61.59,62.87 57.78,62.87 57.15,62.23 56.52,62.23 | v60.33,55.88 61.59,55.88 | v53.34,45.72 55.24,45.72 57.15,47.62 63.98,47.62 64.62,46.99 R15.1 | JP2.4 41.13,41.91 IC6.4
  Top 0.406: J2.2 6.99,46.35 6.99,46.99 7.77,47.78 R48.2 R47.2 | C25.1 56.52,62.23 | LED6.A LED7.A | R16.1 64.77,62.23 64.14,61.59 C26.1 | D5.A 5.95,14.84 5.08,13.97 2.54,13.97 1.27,12.7 1.27,4.45 2.54,3.17 C13.2
  Top 0.61: J1.VBUS 12.09,26.69 12.7,27.3 12.7,32.38 3.81,41.27 3.81,45.09 4.45,45.72 J2.2 | X2.3 82.08,55.88 76.83,55.88 74.93,57.78 74.93,62.23 73.03,64.14 43.18,64.14 42.13,63.09 LED6.A
  Top 0.813: 48.22,30.86 D3.C | D4.A 52.7,38.44 52.7,37.47 52.07,36.83
  Top 1.016: IC6.4 IC6.2 42.29,32.04 C38.+ v46.97,29.59 47.58,29.59 D3.C 48.73,33.49 v48.9,33.66 49.53,34.29 C35.1 51.44,35.13 51.44,36.53 D4.A
  Bottom 0.305: v20.32,35.56 20.45,35.69 C19.1 21.09,36.83 19.68,36.83 19.05,36.2 19.05,32.26 C23.1 22.09,27.81 v21.59,27.3 | v27.3,31.75 27.81,30.98 C20.1 | C21.1 29.21,36.83 29.84,37.47 v29.84,38.73 29.84,42.55 30.48,43.18 30.48,47.62 v29.84,48.26 | v16.51,24.77 16.51,26.69
  Bottom 0.61: J1.VBUS 16.51,26.69 20.98,26.69 v21.59,27.3 | v20.32,35.56 15.88,40.01 5.08,40.01 3.81,41.27 3.81,45.09 4.45,45.72 J2.2 | X2.3 82.17,52.07 75.56,52.07 71.75,55.88 v60.33,55.88 59.69,55.88 59.05,55.24 59.05,51.44 v53.34,45.72 52.07,44.45 50.8,44.45 48.9,42.55 v48.9,33.66
  Bottom 1.016: v46.97,29.59 46.97,18.14 45.36,16.54 38.12,16.54 JP1.3
  pour Top (isolate 0.406, no thermals): 43.81,31.11 43.81,37.47 45.72,39.37 45.72,41.91 38.73,41.91 38.73,36.83 40.64,36.83 41.27,36.2 41.27,31.11
+7V
  Top 0.61: R6.2 59.28,43.69 L1.1 58.01,42.16
  Top 0.813: 48.35,38.73 D4.C 48.47,38.95 50.16,40.64 52.7,40.64 53.09,41.02 C33.1 53.32,42.57 L1.1
  Top 1.016: IC6.3 44.59,36.84 45.72,37.97 D4.C
+12V  (via drill 0.35)  (1 unrouted)
  Top 0.305: R19.2 67.31,33.02 68.68,31.62 76.33,31.62 76.83,31.11 | X2.14 78.58,41.27
  Top 0.406: R75.2 41.91,52.7 41.27,52.07 41.27,50.16 40.64,49.53 R49.2 39.52,48.11 40.64,46.99 41.91,46.99 42.55,47.62 43.81,47.62 44.45,46.99 44.45,44.7 45.21,43.94 47.75,43.94 48.26,44.45 57.4,44.45 57.91,44.96 57.91,45.97 58.42,46.48 63.5,46.48 64.47,45.36 73.36,45.36 73.95,44.79 D1.A
  Top 0.508: 76.83,31.11 87.63,31.11
  Top 1.016: D1.A 77.5,43.18 | 77.5,43.18 78.53,42.12 X2.14 | 77.5,43.18 77.8,43.48 85.6,43.48 87.63,41.45 87.63,31.11 87.63,1.52
  Bottom 1.016: v87.66,1.57 39.32,1.57 38.1,2.54 JP1.1
BATT-CPU  (via drill 0.35)
  Top 0.305: IC1.93 22.9,43.17 23.9,44.17 27.67,44.17 28.03,43.81 v29.21,43.81 37.47,43.81 38.1,44.45 38.1,51.92 R41.2 39.37,53.19 | IC5.4 23.8,51.1 24.13,51.44 v24.77,51.44
  Top 0.406: C2.1 38.1,55.75 38.1,54.76 R41.2
  Bottom 0.305: v24.77,51.44 25.4,51.44 29.21,47.62 v29.21,43.81
CLT-CPU  (via drill 0.35)
  Top 0.305: 23.8,46.35 23.8,46.01 21.4,43.61 IC1.96 | 23.8,46.35 IC5.3 | 23.8,46.35 v24.77,46.35 | R44.2 16.51,50.95 v16.51,49.53
  Top 0.406: C8.1 12.7,55.75 12.7,54.76 R44.2
  Bottom 0.305: v16.51,49.53 19.68,46.35 v24.77,46.35
CLT-IN  (via drill 0.35)
  Top 0.406: C7.1 10.79,60.96 9.53,59.69 v9.53,59.05 9.53,55.09 R44.1 14.12,50.5 R47.1
  Bottom 0.508: X2.2 81.78,55.88 76.2,55.88 73.03,59.05 31.75,59.05 28.57,55.88 22.23,55.88 17.14,60.96 11.43,60.96 v9.53,59.05
COIL-1-OUT
  Top 2.032: 71.75,5.08 S1.3
  Top 2.54: S1.3 80.64,5.08 84.67,9.1 X1.3
COIL-2-OUT
  Top 2.54: S2.3 78.28,12.7 X1.6
COIL-3-OUT
  Top 2.54: X1.4 77.22,21.98 75.56,20.32 S3.3
COIL-4-OUT
  Top 2.54: S4.3 80.64,27.94 84.45,24.13 84.45,22.19 X1.1
GND  (via drill 0.35)  (1 unrouted)
  Top 0.305: C17.2 C18.2 v11.43,19.68 | C22.2 v13.97,3.17 C13.1 | C15.2 v27.94,15.24 | v27.94,15.24 C14.2 | U$2.1 18.57,11.43 v19.68,11.43 | IC1.11 18.68,34.02 v20.32,33.02 | v28.57,38.73 28.9,39.06 IC1.81 28.9,42.23 29.84,43.18 34.29,43.18 | v23.5,27.3 22.4,26.21 IC1.32 22.4,17.32 21.84,16.76 21.84,13.84 22.23,13.34 27.3,13.34 27.94,13.97 v27.94,15.24 | IC5.2 22.86,48.26 23.5,48.9 v24.13,48.9 | IC2.2 27.94,48.26 27.3,48.9 v26.67,48.9 26.04,49.53 26.04,50.79 26.54,51.3 26.54,51.32 27.12,51.89 27.94,51.89 28.57,52.53 28.57,53.98 27.94,54.61 27.94,56.01 C10.2 | v26.67,34.29 28.44,32.52 IC1.62 39.86,32.52 39.99,32.38 | 34.29,43.18 38.1,43.18 39.52,44.6 R50.1 | U$10.11 61.59,53.02 | 61.59,53.02 60.33,53.02 | 59.05,53.02 U$10.6 56.83,53.02 56.52,52.7 56.52,52.07 56.83,51.75 U$10.8 | U$10.3 58.74,54.93 59.05,54.61 | 59.05,54.61 59.05,53.02 | U$10.1 58.74,56.2 59.05,55.88 | 59.05,55.88 59.05,54.61 | U$10.13 61.91,54.29 61.59,53.98 61.59,53.02 | 59.56,58.42 C24.2 C26.2 | 59.56,58.42 59.56,56.38 59.05,55.88 | C25.2 54.55,60.89 54.55,58.74 54.86,58.42 59.56,58.42 | 39.5,29.84 39.75,29.59 | 59.05,53.02 60.33,53.02 | 60.33,53.02 v60.33,53.34 | 69.56,39.03 D2.A | JP2.3 35.56,39.37 v34.29,40.64 34.29,43.18
  Top 0.406: v8.26,64.14 7.75,63.63 C5.2 C6.2 | v14.61,64.14 14.1,63.63 C7.2 C8.2 | v20.95,64.14 20.45,63.63 C3.2 C4.2 | v27.3,64.14 26.8,63.63 C9.2 C10.2 | v33.66,64.14 33.15,63.63 C11.2 C12.2 | v40.01,64.14 39.5,63.63 C1.2 C2.2 | R50.1 R74.2 43.18,44.45 44.83,42.8 48.51,42.8 | 48.51,42.8 C33.2 | v47.62,42.55 48.51,42.8 | R20.2 8.38,18.41 C17.2
  Top 0.508: U$1.1 66.99,37.78 67.31,37.47 67.94,37.47 69.2,38.72 69.2,39.03 | C31.2 71.73,32.18 74.93,32.18 76.2,33.45 76.2,38.1 77.47,39.37 80.64,39.37 82.6,41.33 X2.6
  Top 0.61: R36.2 R31.1 | R37.1 52.86,4.29 51.44,5.71 v51.44,6.35 51.44,6.99 50.8,7.62 IC4.3 | 52.86,27.46 R30.2 52.86,25.55 51.44,24.13 v51.44,22.86 51.44,21.59 50.8,20.95 IC3.3 | Q4.2 41.59,54.93 39.5,57.02 C2.2 | 69.2,39.03 69.56,39.03 | R3.2 66.32,41.91 67.31,41.91 v67.94,41.27 67.94,40.64 69.22,39.37 D2.A 69.85,38.73 70.36,38.23 C30.2 70.36,33.66 C31.2
  Top 0.813: R36.2 v55.24,12.7 | C35.2 53.39,31 D3.A 52.86,30.46 R30.2
  Top 1.016: IC6.1 39.99,32.38 39.99,29.86 40.01,29.84 39.75,29.59 C38.-
  Bottom 0.305: v13.97,3.17 13.97,5.71 v19.68,11.43 | v19.68,11.43 23.5,15.24 v27.94,15.24 | v19.68,11.43 v11.43,19.68 9.08,22.04 J1.GND | v20.32,33.02 20.45,32.89 C19.2 23.5,32.89 | 23.5,32.89 23.62,32.89 24.77,31.75 24.77,29.34 C23.2 24.89,28.07 24.13,27.3 v23.5,27.3 | C20.2 27.18,33.78 v26.67,34.29 26.04,34.92 | 26.04,34.92 25.91,35.05 C21.2 25.91,37.97 26.67,38.73 v28.57,38.73 28.57,42.55 27.94,43.18 IC2.2 v26.67,48.9 v24.13,48.9 24.13,50.16 22.86,51.44 20.32,51.44 19.68,50.8 19.68,49.53 22.23,46.99 24.43,46.99 24.48,47.04 25.35,47.04 26.04,46.35 26.04,45.72 25.4,45.09 24.77,45.09 24.13,45.72 J2.6 | 23.5,32.89 25.53,34.92 26.04,34.92
  Bottom 0.406: v8.26,64.14 v14.61,64.14 v20.95,64.14 v27.3,64.14 v33.66,64.14 v40.01,64.14 | v51.44,22.86 51.44,29.21 47.62,33.02 v47.62,42.55
  Bottom 0.61: X2.6 81.28,44.08 81.28,46.35 80.01,47.62 74.93,47.62 74.3,48.26 63.5,48.26 60.33,51.44 v60.33,53.34 | v51.44,6.35 51.44,8.89 v55.24,12.7 | v51.44,22.86 49.53,22.86
  Bottom 0.813: v55.24,12.7 49.53,19.05 49.53,22.86
  other vias: 65.41,27.94 64.14,27.94 62.87,27.94 62.23,27.3 62.23,26.04 65.41,20.32 64.14,20.32 62.87,20.32 62.23,19.68 62.23,18.41 65.41,12.7 64.14,12.7 62.87,12.7 62.23,12.06 62.23,10.79 65.41,5.08 64.14,5.08 62.87,5.08 62.23,4.45 62.23,3.17 38.73,25.4 38.73,21.59 43.18,21.59 43.18,25.4 14.61,45.72 17.14,42.55 2.54,48.26 2.54,37.47 87,60.33 87,46.99 48.26,47.62 41.27,53.98 27.3,43.18 34.92,6.99 34.92,3.17 24.77,1.91 6.35,1.91 81.28,41.91 56.52,40.01 67.94,36.2 17.78,25.4
  pour Top (no thermals): 66.04,1.91 66.04,5.71 61.59,5.71 61.59,1.91
  pour Top (no thermals): 66.04,9.53 66.04,13.34 61.59,13.34 61.59,9.53
  pour Top (no thermals): 66.04,17.14 66.04,20.95 61.59,20.95 61.59,17.14
  pour Top (no thermals): 66.04,24.77 66.04,28.57 61.59,28.57 61.59,24.77
  pour Bottom (no thermals): 89.53,30.48 60.33,30.48 60.33,2.92 89.53,2.92
  pour Bottom (isolate 0.406): 0,66.67 0,0 58.42,0 58.42,31.11 58.42,31.75 88.9,31.75 88.9,66.67
  pour Top (isolate 0.305, rank 2): 0,66.67 0,0 59.05,0 59.05,32.38 89.53,32.38 89.53,66.67
IAT-CPU
  Top 0.305: IC1.97 20.9,43.76 21.92,44.78 IC5.1
  Top 0.406: C6.1 6.35,55.75 6.35,54.76 R43.2 9.68,51.44 12.06,51.44 12.7,50.8 12.7,48.26 13.34,47.62 IC5.1
IAT-IN  (via drill 0.35)
  Top 0.406: R48.1 R43.1 3.81,53.34 2.54,54.61 v2.54,59.05 2.54,59.69 3.81,60.96 C5.1
  Bottom 0.508: X2.1 84.03,63.29 83.19,64.14 76.2,64.14 74.93,62.87 6.35,62.87 v2.54,59.05
IGN-1
  Top 0.305: IC1.52 33.42,27.5 34.28,27.5 35.56,26.22 35.56,10.79 37.47,8.89 43.18,8.89 43.81,8.26 43.81,5.71 42.39,4.29 R38.1
IGN-1-IG  (via drill 0.35)
  Top 0.61: IC4.5 55.24,6.35 v55.88,5.71 55.88,4.45 56.67,3.66 R2.1
  Bottom 0.813: R39.1 53.34,17.78 57.15,13.97 57.15,12.06 56.52,11.43 55.88,11.43 54.61,10.16 54.61,7.62 v55.88,5.71
IGN-1-OUT
  Bottom 0.813: R39.2 53.34,43.81 56.52,46.99 73.66,46.99 76.2,44.45 76.2,40.1 76.93,39.37 80.01,39.37 82.55,36.83 83.73,36.83 X2.7
IGN-2
  Top 0.305: IC1.50 31.4,23.84 31.75,23.5 34.29,23.5 34.92,22.86 34.92,10.16 37.72,7.37 R35.1 42.16,7.37
IGN-2-IG  (via drill 0.35)
  Top 0.61: R5.1 56.67,8.89 v55.88,8.89 IC4.7
  Bottom 0.813: R40.1 59.05,35.56 54.61,31.11 54.61,18.41 58.42,14.61 58.42,11.43 v55.88,8.89
IGN-2-OUT
  Bottom 0.813: R40.2 59.05,43.81 60.96,45.72 73.03,45.72 74.95,43.79 74.95,38.71 76.54,37.12 X2.15
IGN-3
  Top 0.305: IC1.54 33.42,28.5 34.28,28.5 36.2,26.58 36.2,19.68 38.1,17.78 40.01,17.78 40.64,17.14 40.64,15.88 41.27,15.24 R32.1
IGN-3-IG  (via drill 0.35)
  Top 0.61: IC3.5 v55.88,19.68 56.67,18.9 R7.1
  Bottom 0.813: R33.1 64.77,34.92 63.5,33.66 59.05,33.66 55.88,30.48 v55.88,19.68
IGN-3-OUT
  Bottom 0.813: R33.2 64.77,43.81 65.41,44.45 72.39,44.45 73.99,42.85 73.99,37.13 76.2,34.92 80.64,34.92 82.64,32.92 X2.8
IGN-4
  Top 0.305: IC1.56 33.42,29.5 34.28,29.5 36.83,26.95 36.83,20.32 38.35,18.8 R29.1
IGN-4-IG  (via drill 0.35)
  Top 0.61: IC3.7 55.24,22.23 v57.15,24.77 57.78,25.4 R9.1
  Bottom 0.813: R34.1 70.48,33.66 69.22,32.38 59.69,32.38 57.15,29.84 v57.15,24.77
IGN-4-OUT
  Bottom 0.813: X2.16 75.03,32.92 73.03,34.92 73.03,38.1 72.39,38.73 71.12,38.73 70.48,39.37 R34.2
MAP-CPU
  Top 0.305: IC1.94 22.4,43.32 23.71,44.63 27.48,44.63 28.88,46.02 28.88,46.35 | IC2.3 28.88,46.35 | 28.88,46.35 29.84,46.35 32.38,48.9 32.38,51.44 33.17,52.22 R46.2
  Top 0.406: C12.1 31.75,55.75 31.75,54.76 R46.2
MAP-IN  (via drill 0.35)
  Top 0.406: R46.1 30.33,53.49 28.57,55.24 v28.57,59.05 28.57,59.19 C11.1
  Bottom 0.508: X2.10 75.86,58.12 73.66,60.33 29.84,60.33 v28.57,59.05
MISO-CPU
  Top 0.305: IC1.22 15.93,28.52 13.34,31.11 13.34,33.02 6.35,40.01 J2.1
MOSI-CPU
  Top 0.305: IC1.21 17.38,29.04 16.06,29.04 13.97,31.13 13.97,33.02 13.79,33.2 13.79,33.21 7.62,39.38 7.62,44.45 J2.4
N$1
  Top 0.61: R2.2 58.66,7.38 S1.1
N$2
  Top 0.305: U$2.5 13.34,12.7 13.97,13.34 13.97,20.32 13.79,20.5 13.79,20.51 9.71,24.59 7.62,24.59 6.35,25.86 6.35,28.57 6.96,29.19 J1.D+
N$3
  Top 0.305: U$2.6 12.06,12.7 13.34,13.97 13.34,20.32 9.53,24.13 6.99,24.13 5.71,25.4 5.71,29.21 7.62,31.11 10.79,31.11 11.06,30.85 J1.D-
N$4
  Top 0.61: R5.2 58.66,15 S2.1
N$5
  Top 0.305: IC1.34 23.4,22.32 24.13,21.59 29.21,21.59 30.48,20.32 | 30.48,20.32 Y2.2 | C14.1 32.52,16.38 30.48,18.41 30.48,20.32
N$6
  Top 0.305: IC1.33 22.9,21.55 24.13,20.32 25.4,20.32 | 25.4,20.32 Y2.1 | C15.1 23.36,15.74 25.4,17.78 25.4,20.32
N$7
  Top 0.61: R7.2 58.66,22.62 S3.1
N$8
  Top 0.406: R20.1 3.02,15.95 D5.C
N$9
  Top 0.305: C16.2 17.78,13.97 18.41,13.34 19.68,13.34 21.59,11.43 24.21,11.43 24.77,10.87 24.77,5.08 24.13,4.45 21.59,4.45 20.32,5.71 19.05,8.26 15.24,8.26 14.61,7.62 U$2.13
N$10
  Top 0.61: R9.2 58.66,30.24 S4.1
N$11
  Top 0.254: R17.2 56.03,60.11 54.68,61.47 54.68,63.25 54.93,63.5 67.94,63.5
  Top 0.305: R16.2 68.73,62.71 67.94,63.5
  Top 0.61: HALL1.2 70.99,61.72 70.48,62.23 R16.2
N$12
  Top 0.305: R8.1 65.41,51.44 64.45,52.39 U$10.10 61.28,52.39 59.56,50.67 C27.1
N$14
  Top 0.305: 65.41,53.98 65.71,54.38 R12.1 | C28.2 67.94,59.05
  Top 0.406: U$10.15 64.45,55.56 65.64,54.38 65.71,54.38 | C28.2 67.31,58.29 67.31,56.03 R12.1
N$15
  Top 0.305: Y1.1 6.48,6.48 8.89,8.89 9.53,8.89 10.79,10.16 U$2.7 10.79,12.7 11.43,13.34 C18.1
N$16
  Top 0.305: C17.1 8.89,13.34 9.53,12.7 U$2.8 9.53,10.16 8.89,10.16 7.75,11.3 Y1.2
N$17
  Top 0.305: R10.2 VR2+.2
N$18
  Top 0.305: U$10.4 54.04,54.29 VR1.1
N$19
  Top 0.305: VR1.3 53.19,58.19 R17.1
N$20
  Top 0.305: U$10.5 56.2,53.66 55.88,53.34 55.88,52.07 55.5,51.69 VR2.3
N$21
  Top 0.305: R18.1 51.21,48.64 VR2.1
N$22  (1 unrouted)
  Top 0.61: 70.44,42.25 69.56,42.25 | 73.36,39.37 D1.C 69.56,43.48 69.22,43.81 65.41,43.81 64.77,43.18 64.77,40.01 65.09,39.69 U$1.3 | 73.36,39.37 D2.C | 73.36,39.37 73.36,36.41 C30.1 73.1,36.14 C31.1
N$23
  Top 0.61: U$1.6 63.47,35.53 62.87,34.92 61.59,34.92 60.45,33.78 C34.2
N$24
  Top 0.61: U$1.5 64.77,38.73 64.77,34.92 63.98,34.14 R19.1
N$28
  Top 0.305: R18.2 51.59,46.99 55.24,46.99 56.52,48.26 67.94,48.26 68.73,47.47 R15.2
  Top 0.406: HALL2.2 R15.2
N$29
  Top 0.406: R71.1 44.45,51.1 44.45,56.64 44.26,56.83 Q4.1
  Top 0.61: R74.1 R71.1
N$33
  Top 0.61: R29.2 45.09,20.32 46.99,22.23 | 46.99,22.23 IC3.2 | R30.1 47.62,26.04 46.99,25.4 46.99,22.23
N$34
  Top 0.61: R31.2 46.99,17.14 | R32.2 46.99,15.24 46.99,17.14 | IC3.4 47.62,19.68 46.99,19.05 46.99,17.14
N$35
  Top 0.305: U$10.9 63.82,51.75 64.14,51.44 64.14,49.53 | 64.14,49.53 R10.1 | C27.2 64.14,49.53
N$36
  Top 0.305: R11.1 65.89,59.03 C28.1
  Top 0.406: U$10.16 63.82,56.2 64.77,57.15 R11.1
N$37
  Top 0.61: IC4.2 47.62,8.89 46.99,8.26 | 46.99,8.26 46.99,7.62 46.74,7.37 R35.2 | R36.1 48.26,12.7 46.99,11.43 46.99,8.26
N$38
  Top 0.61: 46.35,3.81 46.99,4.45 46.99,5.71 47.62,6.35 IC4.4 | 46.35,3.81 R38.2 | R37.2 46.35,3.81
N$42
  Top 0.406: C1.1 34.92,59.19 34.92,55.09 R41.1 R49.1 R50.2
N$48
  Top 0.61: VR1+.2 71.12,57.66 71.12,57.15 R11.2
N$49
  Top 0.406: R14.1 LED7.C
N$50
  Top 0.406: R13.1 LED6.C
N$100
  Top 0.305: R1.1 D19.C
N$101
  Top 0.305: R51.1 D18.C
O2-CPU  (via drill 0.35)
  Top 0.305: IC1.89 24.9,43.31 24.63,43.31 v24.77,43.18 | R42.2 21.59,53.34 21.92,53.01 IC5.6 v20.95,50.16
  Top 0.406: C4.1 19.05,55.75 19.05,54.76 R42.2
  Bottom 0.305: v24.77,43.18 26.67,45.09 26.67,46.99 26.04,47.62 22.86,47.62 20.95,49.53 v20.95,50.16
O2-IN  (via drill 0.35)
  Top 0.406: R42.1 15.88,55.09 v15.88,59.05 15.88,59.19 C3.1
  Bottom 0.508: 21,53.92 20.64,54.29 | 20.64,54.29 v15.88,59.05 | 20.64,54.29 28.89,54.29 32.38,57.78 71.75,57.78 75.61,53.92 X2.11
OUT-SELECT
  Top 0.813: IC4.6 52.7,7.62 51.45,8.85 51.45,15.06 51.45,19.61 52.77,20.95 IC3.6
  Top 1.016: 51.45,15.06 49.05,15.06 46.66,12.68 40.66,12.68 39.37,13.97 JP1.2
RESET-CPU
  Top 0.305: C16.1 20.3,17.91 R4.2 20.32,20.32 21.4,21.4 IC1.30 21.4,26.23 20.32,27.3 20.32,28.57 21.59,29.84 21.59,37.47 20.32,38.73 19.68,38.73 18.41,40.01 12.06,40.01 11.43,40.64 J2.5
RX3
  Top 0.305: IC1.63 38.1,33.02 38.73,33.66 38.73,35.56 37.47,36.83 JP2.2
RX-CPU  (via drill 0.35)
  Top 0.305: R51.2 17.78,10.16 17.14,10.79 U$2.2 17.14,12.7 15.24,14.61 v15.24,27.94 | IC1.2 13.76,38.52 v13.34,38.1
  Bottom 0.305: v15.24,27.94 15.88,28.57 15.88,38.1 15.24,38.73 13.97,38.73 v13.34,38.1
SCK-CPU
  Top 0.305: IC1.20 16.22,29.52 14.61,31.14 14.61,33.02 14.43,33.2 14.43,33.22 8.9,38.75 8.9,43.17 J2.3
SW  (via drill 0.35)
  Top 0.61: U$1.2 v67.31,38.73 | L1.2 v58.42,38.1
  Top 0.813: C34.1 58.42,33.78 L1.2
  Bottom 0.61: v58.42,38.1 59.05,38.73 v67.31,38.73
TACHO
  Top 0.61: Q4.3 46.99,55.88 47.62,55.24 47.62,53.34 46.99,52.7 R75.1
TACHO-CPU  (via drill 0.35)
  Top 0.305: IC1.60 35.16,31.52 35.56,31.11 v35.56,30.48 | R71.2 41.91,49.53 41.27,48.9 v41.27,48.26
  Bottom 0.406: v35.56,30.48 33.02,33.02 33.02,43.81 37.47,48.26 v41.27,48.26
TPS-CPU
  Top 0.305: IC1.95 21.92,41.04 21.92,43.49 23.52,45.09 25.4,45.09 26.67,46.35 | 26.67,46.35 27,46.69 IC2.1 | 26.67,46.35 25.4,47.62 25.4,50.8 26.04,51.44 26.04,52.7 26.67,53.34 R45.2
  Top 0.406: C10.1 25.4,55.75 25.4,54.76 R45.2
TPS-IN  (via drill 0.35)
  Top 0.406: R45.1 22.23,55.09 v22.23,59.05 22.23,59.19 C9.1
  Bottom 0.508: v22.23,59.05 25.5,61.69 77.89,61.69 X2.9
TX3
  Top 0.305: IC1.64 35.42,33.52 JP2.1
TX-CPU  (via drill 0.35)
  Top 0.305: R1.2 20.95,6.35 19.68,8.89 16.51,8.89 15.88,9.53 U$2.3 15.88,12.7 14.61,13.97 14.61,27.3 v13.97,27.94 | IC1.3 15.16,38.02 v14.61,37.47
  Bottom 0.305: v13.97,27.94 13.97,28.57 14.61,29.21 v14.61,37.47
VFB
  Top 0.61: U$1.4 63.19,39.69 62.87,40.01 62.87,42.55 R3.1
  Top 0.813: R3.1 63.35,43.87 R6.1
VR1+
  Top 0.305: VR1+.1 HALL1.1
  Top 0.61: X2.12 74.3,53.96 74.3,57.15 73.66,57.78 VR1+.1
VR1+CPU  (via drill 0.35)
  Top 0.305: IC1.45 28.9,28.27 v29.21,28.57 | IC2.4 29.21,50.16 v30.48,49.53
  Top 0.406: R13.2 50.8,62.23 51.44,61.59 v51.44,56.52 52.07,55.88 VR1.2
  Bottom 0.305: v29.21,28.57 29.84,29.21 30.48,29.21 31.11,29.84 31.11,48.9 v30.48,49.53
  Bottom 0.406: v51.44,56.52 33.02,56.52 29.21,52.7 29.21,50.16 29.84,49.53 v30.48,49.53
VR1-
  Top 0.61: R12.2 71.75,54.61 76.2,50.16 76.2,48.9 76.93,48.09 82.45,48.09 X2.4
VR2+
  Top 0.305: HALL2.1 VR2+.1
  Top 0.61: X2.13 75.76,45.52 74.3,46.99 HALL2.1
VR2+CPU  (via drill 0.35)
  Top 0.305: IC2.6 27,51.13 27.3,51.44 29.84,51.44 v30.48,50.8 | IC1.46 29.4,26.23 v30.48,27.3
  Top 0.406: VR2.2 52.7,50.16 49.68,53.19 49.68,54.61 49.68,55.09 | 49.68,55.09 R14.2 | v49.53,55.24 49.68,55.09
  Bottom 0.305: v30.48,27.3 31.75,28.57 31.75,49.53 v30.48,50.8
  Bottom 0.406: v49.53,55.24 33.66,55.24 30.48,52.07 v30.48,50.8
VR2-
  Top 0.61: R8.2 72.39,52.07 74.93,49.53 74.93,48.26 76.16,47.11 82.5,47.11 X2.5

### Text on the board
_tsilk: IGNITION | Powered by | Speeduino | Nick Hay 2018 | Version 1.0 | z_nick_hay_z@hotmail.com